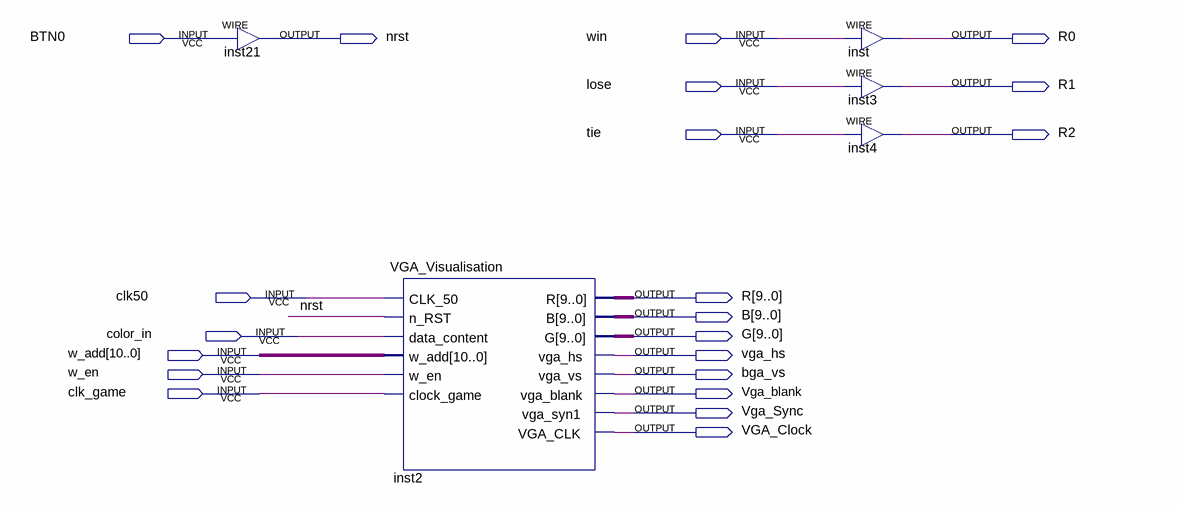
[diagram p0: schematic sheet]
// Quartus schematic user_interface.bdf as structural Verilog: 5 symbols, 21 pins
module user_interface (
  input  BTN0,
  input  win,
  input  lose,
  input  tie,
  input  clk50,
  input  color_in,
  input  [10:0] w_add,
  input  w_en,
  input  clk_game,
  output nrst,
  output R0,
  output R1,
  output R2,
  output [9:0] R,
  output [9:0] B,
  output [9:0] G,
  output vga_hs,
  output bga_vs,
  output Vga_blank,
  output Vga_Sync,
  output VGA_Clock
);

  assign nrst = BTN0;  // WIRE inst21
  VGA_Visualisation inst2 (
    .CLK_50(clk50), .n_RST(nrst), .data_content(color_in), .w_add(w_add), .w_en(w_en), .clock_game(clk_game),
    .R(R), .B(B), .G(G), .vga_hs(vga_hs), .vga_vs(bga_vs), .vga_blank(Vga_blank), .vga_syn1(Vga_Sync),
    .VGA_CLK(VGA_Clock));
  assign R[0] = win;  // WIRE inst
  assign R[1] = lose;  // WIRE inst3
  assign R[2] = tie;  // WIRE inst4

  assign R0 = R[0];
  assign R1 = R[1];
  assign R2 = R[2];
endmodule
